# Altium schematic sheet Power.SchDoc
size B; Engineer: Soo-Hyun Yoo; Organization: OSURC Aerial; Revision: 4.0; ProjectName: Flight Controller
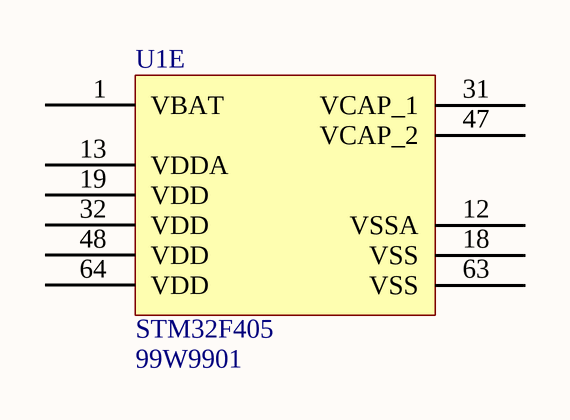
[diagram p0: Power.SchDoc]

## Parts
U1  STM32F405  Supplier Part Number 1: 99W9901  [LQFP64]  (part E of 5)

## Nets

Not connected (* = marked no-connect by the designer): U1 1(VBAT) 12(VSSA) 13(VDDA) 18(VSS) 19(VDD) 31(VCAP_1) 32(VDD) 47(VCAP_2) 48(VDD) 63(VSS) 64(VDD)

## Library data of the parts
U1 = STM32F405: Supplier 1: Newark